# EAGLE design pot-boardE (EAGLE 6.6.0)
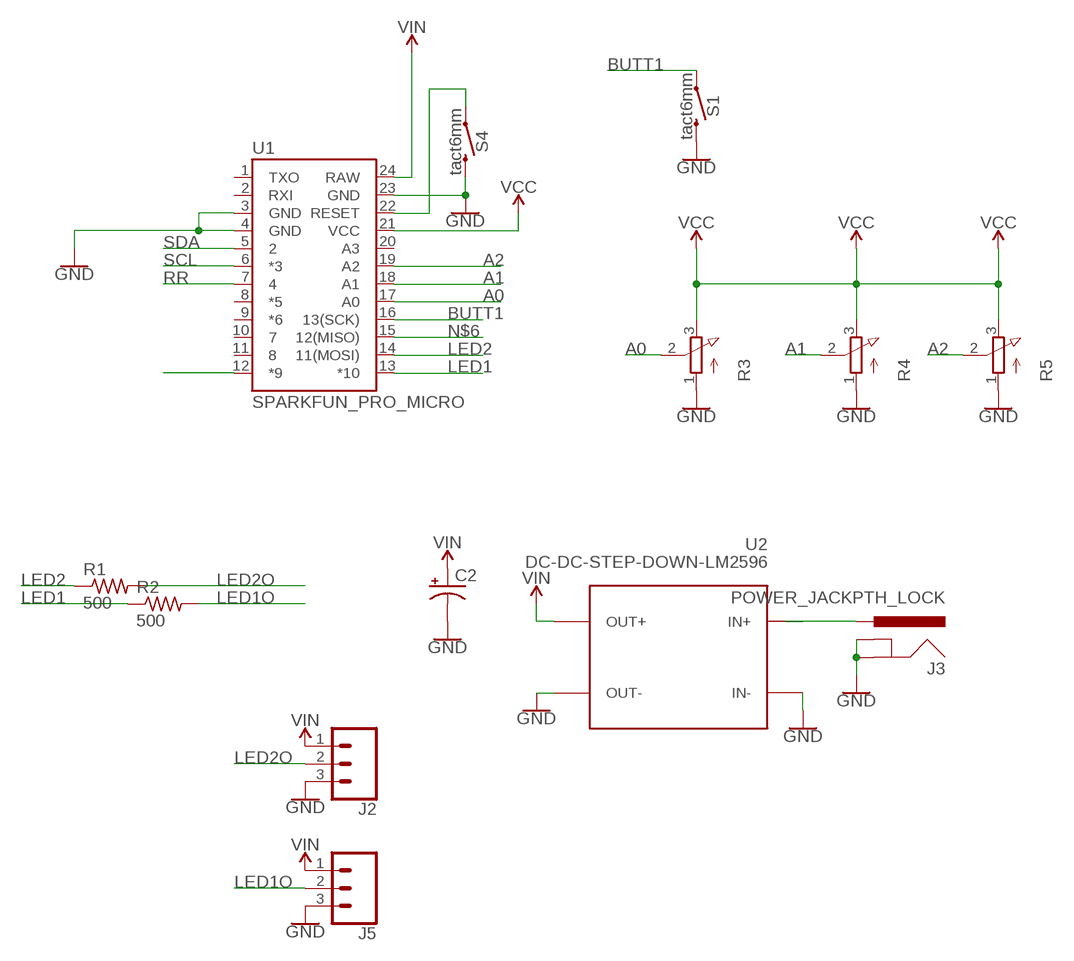
[diagram p0: schematic, sheet 1]

## Parts
C2  CPOL-USE3.5-8  [E3,5-8]
J2  CONN_03  [1X03]
J3  POWER_JACKPTH_LOCK  [POWER_JACK_PTH_LOCK]
J5  CONN_03  [1X03]
R1  500  R-US_R0805  [R0805]
R2  500  R-US_R0805  [R0805]
R3  3RP/1610N  [3RP/1610N]
R4  3RP/1610N  [3RP/1610N]
R5  3RP/1610N  [3RP/1610N]
S1  tact6mm  MOMENTARY-SWITCH-SPST-PTH-6.0MM  [TACTILE_SWITCH_PTH_6.0MM]
S4  tact6mm  MOMENTARY-SWITCH-SPST-PTH-6.0MM  [TACTILE_SWITCH_PTH_6.0MM]
U1  SPARKFUN_PRO_MICRO  [SPARKFUN_PRO_MICRO]
U2  DC-DC-STEP-DOWN-LM2596  [DC-DC-STEP-DOWN-LM2596]

## Nets
A0: R3.2(S) U1.17(A0)
A1: R4.2(S) U1.18(A1)
A2: R5.2(S) U1.19(A2)
BUTT1: S1.1 U1.16(13(SCK))
GND: C2.- J2.3 J3.GND J3.GNDBREAK J5.3 R3.1(A) R4.1(A) R5.1(A) S1.3 S4.3 U1.3(GND) U1.4(GND) U1.23(GND) U2.IN- U2.OUT-
LED1: R2.1 U1.13(*10)
LED1O: J5.2 R2.2
LED2: R1.1 U1.14(11(MOSI))
LED2O: J2.2 R1.2
N$1: J3.PWR U2.IN+
N$5: U1.12(*9)
N$6: U1.15(12(MISO))
RESET: S4.1 U1.22(RESET)
RR: U1.7
SCL: U1.6(*3)
SDA: U1.5
VCC: R3.3(E) R4.3(E) R5.3(E) U1.21(VCC)
VIN: C2.+ J2.1 J5.1 U1.24(RAW) U2.OUT+
Unconnected: U1.1(TXO) U1.2(RXI) U1.8(*5) U1.9(*6) U1.10 U1.11 U1.20(A3)

## Library data of the parts
C2 = adafruit:CPOL-US: POLARIZED CAPACITOR, American symbol
J2 J5 = SparkFun-Connectors:CONN_03: Multi connection point. Often used as Generic Header-pin footprint for 0.1 inch spaced/style header connections On any of the 0.1 inch spaced packages, you can populate with these: Break Away Headers - Straight <https://www.sparkfun.com/products/116> (PRT-00116) Break Away Male Headers - Right Angle <https://www.sparkfun.com/products/553> (PRT-00553) Female Headers <https://www.sparkfun.com/products/115> (PRT-00115) Break Away Headers - Machine Pin <https://www.sparkfun.com/products/117> (PRT-00117) Break Away Female Headers - Swiss Machine Pin <https://www.sparkfun.com/products/743> (PRT-00743) Stackable Header - 3 Pin (Female, 0.1") <https://www.sparkfun.com/products/13875> (PRT-13875) For SCREWTERMINALS and SPRING TERMINALS visit here: Screw Terimnals on SparkFun.com <https://www.sparkfun.com/search/results?term=Screw+Terminals> (5mm/3.5mm/2.54mm spacing) This device is also useful as a general connection point to wire up your design to another part of your project. Our various solder wires solder well into these plated through hole pads. Hook-Up Wire - Assortment (Stranded, 22 AWG) <https://www.sparkfun.com/products/11375> (PRT-11375) Hook-Up Wire - Assortment (Solid Core, 22 AWG) <https://www.sparkfun.com/products/11367> (PRT-11367) View the entire wire category on our website here <https://www.sparkfun.com/categories/141> Special notes: Molex polarized connector foot print use with SKU : PRT-08232 with associated crimp pins and housings.
J3 = SparkFun-Connectors:POWER_JACK: Power Jack Connector This is the standard 5.5mm barrel jack for power. The PTH is the most common, proven, reliable, footprint. The Slot footprint only works if the mill layer is transmitted to the PCB fab house so be warned. Here are the connectors we sell at SparkFun: DC Barrel Power Jack/Connector <https://www.sparkfun.com/products/119> (PRT-00119) DC Barrel Power Jack/Connector (SMD) <https://www.sparkfun.com/products/12748> (PRT-12748) DC Barrel Jack Adapter - Breadboard Compatible <https://www.sparkfun.com/products/10811> (PRT-10811) It is used on this SparkFun product (and many, many others): SparkFun RedBoard - Programmed with Arduino <https://www.sparkfun.com/products/12757> (DEV-12757) Also, if you need a mating power supply or connector, please check these out: Wall Adapter Power Supply - 9VDC 650mA <https://www.sparkfun.com/products/298> (TOL-00298) DC Barrel Jack Adapter - Male <https://www.sparkfun.com/products/10287> (PRT-10287); PROD_ID: CONN-08197; SF_ID: PRT-00119
R1 R2 = adafruit:R-US_: RESISTOR, American symbol
R3-R5 = pot:3RP/1610N: 16mm Potentiometer one level Source: http://www.alphapotentiometers.net/html/16mm_pot_2.html
S1 S4 = SparkFun-Switches:MOMENTARY-SWITCH-SPST: Momentary Switch (Pushbutton) - SPST Normally-open (NO) SPST momentary switches (buttons, pushbuttons). Variants PTH-12MM - 12mm square, through-hole Momentary Pushbutton Switch - 12mm Square <https://www.sparkfun.com/products/9190> (COM-09190) PTH-6.0MM, PTH-6.0MM-KIT - 6.0mm square, through-hole Mini Pushbutton Switch <https://www.sparkfun.com/products/97> (COM-00097) KIT package intended for soldering kit's - only one side of pads' copper is exposed. PTH-RIGHT-ANGLE-KIT - Right-angle, through-hole Right Angle Tactile Button <https://www.sparkfun.com/products/10791> - Used on SparkFun BigTime Watch Kit <https://www.sparkfun.com/products/11734> SMD-12MM - 12mm square, surface-mount Tactile Button - SMD (12mm) <https://www.sparkfun.com/products/12993> (COM-12993) Used on SparkFun PicoBoard <https://www.sparkfun.com/products/11888> SMD-4.5MM - 4.5mm Square Trackball Switch Used on SparkFun Blackberry Trackballer Breakout <https://www.sparkfun.com/products/13169> SMD-4.6MMX2.8MM - 4.60mm x 2.80mm, surface mount Used on SparkFun SAMD21 Mini Breakout <https://www.sparkfun.com/products/13664> SMD-5.2MM, SMD-5.2-REDUNDANT - 5.2mm square, surface-mount Mini Pushbutton Switch - SMD <https://www.sparkfun.com/products/8720> (COM-08720) Used on Arduino Pro Mini <https://www.sparkfun.com/products/11114> REDUNDANT package connects both switch circuits together SMD-6.0X3.5MM - 6.0 x 3.5mm, surface mount Momentary Reset Switch SMD <https://www.sparkfun.com/products/8229> (COM-08229) SMD-6.2MM-TALL - 6.2mm square, surface mount Tactile Button - SMD (6mm) <https://www.sparkfun.com/products/12992> Used on SparkFun Digital Sandbox <https://www.sparkfun.com/products/12651> SMD-RIGHT-ANGLE - Right-angle, surface mount Used on SparkFun Block for Intel® Edison - Arduino <https://www.sparkfun.com/products/13036>; PROD_ID: SWCH-08441; SF_SKU: COM-00097
U1 = SparkFun-Boards:SPARKFUN_PRO_MICRO: SparkFun Pro Micro Atmega32U4 compatible footprint. SparkFun Products: 3.3V/8MHz <https://www.sparkfun.com/products/12587> 5V/16MHz <https://www.sparkfun.com/products/12640>
U2 = diy-modules:DC-DC-STEP-DOWN-LM2596: DC/DC Step-Down Regulator based on LM2596-ADJ chip LM2596 datasheet available here: http://www.ti.com/lit/ds/symlink/lm2596.pdf Click here to find device on ebay.com <http://www.ebay.com/sch/lm2596+power+regulator>

## Board
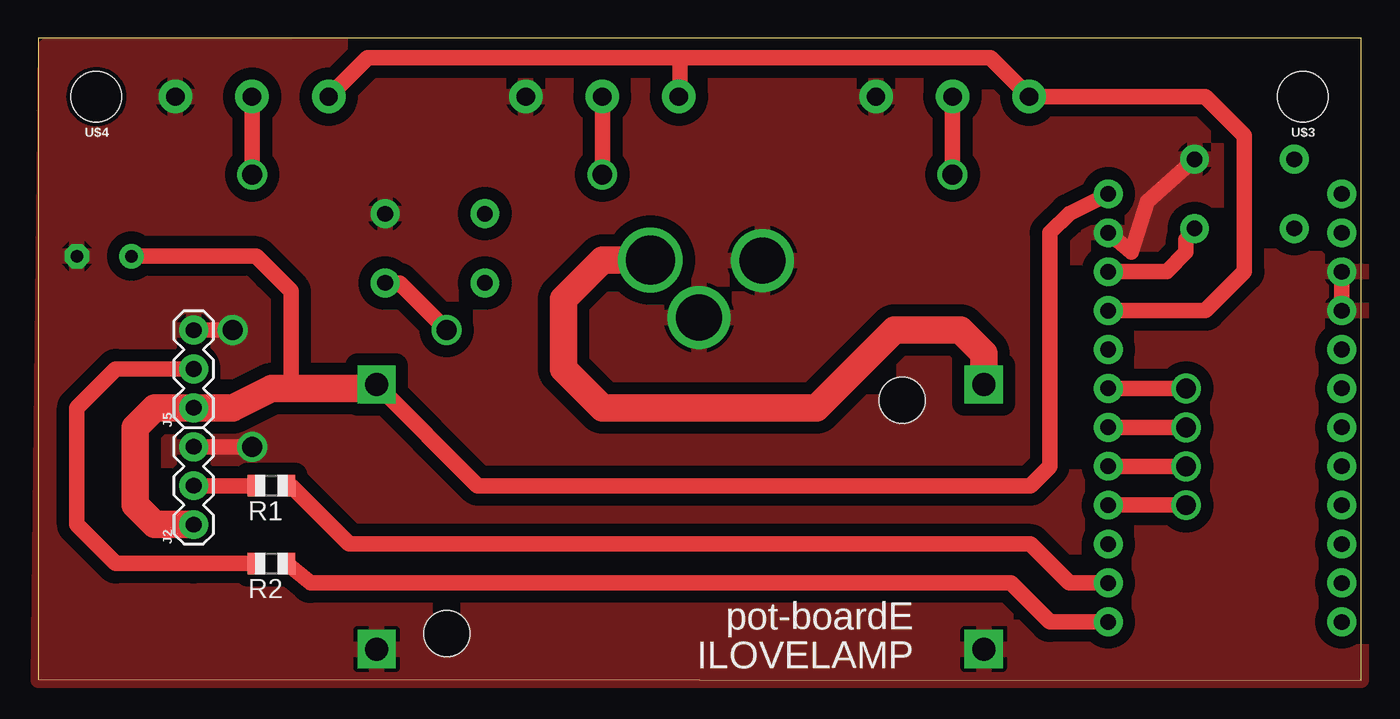
[diagram p1: board, top side]
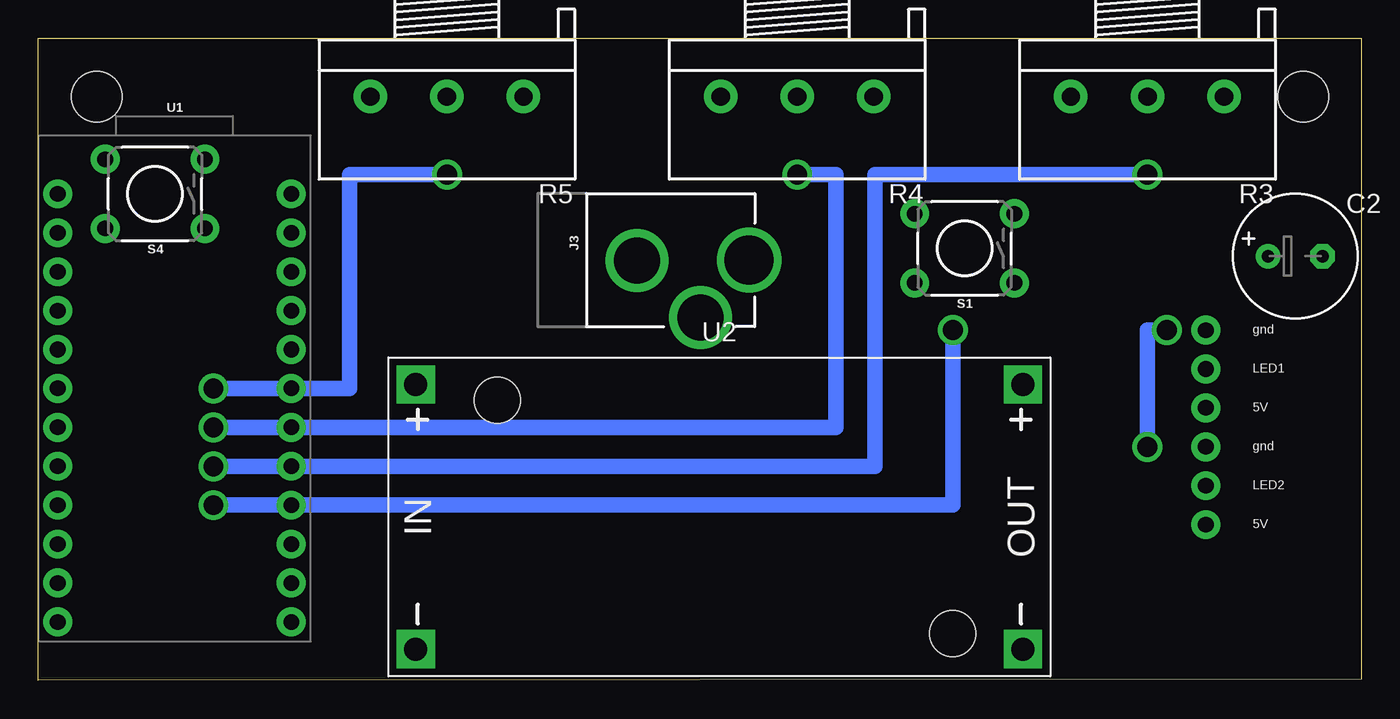
[diagram p2: board, bottom side, seen from below]

Size 86.34 x 41.91 mm. Coordinates in mm from the lower left corner, seen from the top.
Outline: 86.34,41.91 0,41.91 0,0.08 86.34,0 86.34,41.91
Copper layers (1*16): Top 0.035mm / dielectric 1.5mm / Bottom 0.035mm
Design rules "OthermillDRC_1_32_v2": minimum track width 8mil, minimum drill 0.8mm, track to track 0.794003125mm, track to pad 0.794003125mm, pad to pad 0.794003125mm, via to via 0.794003125mm, smd to smd 0mil, copper to edge 0mil, drill to drill 1mil, minimum pad ring 10mil, minimum via ring 10mil, stop-mask expansion 1mil, vias tented up to drill 30mil, thermal gap 10mil

### Footprints (pad centres in the part's own frame; a part is rotated, then mirrored left to right if it is on the bottom)
E3,5-8 = drill 0.813 pad 1.6: + -1.778,0 | drill 0.813 pad 1.6 octagon: - 1.778,0
1X03 = drill 1.016 pad 1.88: 1 0,0; 2 2.54,0; 3 5.08,0
POWER_JACK_PTH_LOCK = drill 2.997 pad 4.115: GND 0.025,6.557; GNDBREAK 3.762,10.7 | drill 3.2 pad 4.115: PWR 0,13.878
R0805 = smd 1.1 x 1.4: 1 -1,0; 2 1,0
3RP/1610N = drill 1.2 pad 2.184: 1 -5,0; 2 0,0; 3 5,0
TACTILE_SWITCH_PTH_6.0MM = drill 1.016 pad 1.88: 1 -3.251,2.261; 2 3.251,2.261; 3 -3.251,-2.261; 4 3.251,-2.261
SPARKFUN_PRO_MICRO = drill 1.016 pad 1.88: 1 -7.62,12.7; 2 -7.62,10.16; 3 -7.62,7.62; 4 -7.62,5.08; 5 -7.62,2.54; 6 -7.62,0; 7 -7.62,-2.54; 8 -7.62,-5.08; 9 -7.62,-7.62; 10 -7.62,-10.16; 11 -7.62,-12.7; 12 -7.62,-15.24; 13 7.62,-15.24; 14 7.62,-12.7; 15 7.62,-10.16; 16 7.62,-7.62; 17 7.62,-5.08; 18 7.62,-2.54; 19 7.62,0; 20 7.62,2.54; 21 7.62,5.08; 22 7.62,7.62; 23 7.62,10.16; 24 7.62,12.7
DC-DC-STEP-DOWN-LM2596 = drill 1.5 pad 2.5 square: IN+ -19.812,8.636; IN- -19.812,-8.636; OUT+ 19.812,8.636; OUT- 19.812,-8.636 | hole 3: -14.478,7.62; 15.24,-7.62
STAND-OFF = hole 3.302: 0,0

### Placement (x,y rotation side)
C2  4.3,27.69 0 bottom
J2  10.14,10.16 90 top
J3  53.83,27.43 270 bottom
J5  10.14,17.78 90 top
R1  15.22,12.7 180 top
R2  15.22,7.62 180 top
R3  13.95,38.1 180 bottom
R4  36.81,38.1 180 bottom
R5  59.67,38.1 180 bottom
S1  25.89,28.19 180 bottom
S4  78.72,31.75 180 bottom
U1  77.45,19.05 0 bottom
U2  41.89,10.67 0 bottom
U$3  [STAND-OFF]  82.53,38.1 180 top
U$4  [STAND-OFF]  3.79,38.1 180 top

### Tracks (layer width: path | path; a pad name or v marks a point on that pad's centre or on a via)
A0  (via drill 1.3)
  Top 1.016: U1.17 v74.91,13.97 | R3.2 v13.95,33.02
  Bottom 1.016: v74.91,13.97 57.13,13.97 39.35,13.97 31.73,13.97 31.73,33.02 v13.95,33.02
A1  (via drill 1.3)
  Top 1.016: U1.18 v74.91,16.51 | R4.2 v36.81,33.02
  Bottom 1.016: v74.91,16.51 58.4,16.51 34.27,16.51 34.27,33.02 v36.81,33.02
A2  (via drill 1.3)
  Top 1.016: U1.19 v74.91,19.05 | R5.2 v59.67,33.02
  Bottom 1.016: v74.91,19.05 66.02,19.05 66.02,33.02 v59.67,33.02
BUTT1  (via drill 1.3)
  Top 1.016: U1.16 v74.91,11.43 | S1.1 23.58,25.93 v26.65,22.86
  Bottom 1.016: v74.91,11.43 31.73,11.43 26.65,11.43 26.65,21.59 v26.65,22.86
GND  (via drill 1.3)
  Top 1.016: U1.3 U1.4 | U1.23 71.35,27.94 72.37,31.24 S4.3 | J2.3 v13.95,15.24 | v12.68,22.86 J5.3
  Bottom 1.016: v13.95,15.24 13.95,22.86 v12.68,22.86
  pour Top: -0.02,0 86.34,0 86.34,41.91 0.49,41.4
LED1
  Top 1.016: U1.13 66.02,3.81 63.48,6.35 17.76,6.35 R2.1
LED1O
  Top 1.016: R2.2 10.14,7.62 5.06,7.62 2.52,10.16 2.52,17.78 5.06,20.32 J5.2
LED2
  Top 1.016: U1.14 67.29,6.35 64.75,8.89 62.21,8.89 20.3,8.89 16.49,12.7 R1.1
LED2O
  Top 1.016: J2.2 R1.2
N$1
  Top 1.778: U2.IN+ 61.7,21.34 61.45,21.59 60.18,22.86 55.86,22.86 50.78,17.78 36.81,17.78 34.27,20.32 34.27,24.89 36.81,27.43 J3.PWR
RESET
  Top 1.016: U1.22 73.64,26.67 74.91,27.94 74.91,28.78 S4.1
VCC
  Top 1.016: 64.67,38.18 R5.3 | R4.3 41.89,38.18 41.89,40.64 | R3.3 21.49,40.64 25.38,40.64 41.89,40.64 | 41.89,40.64 62.13,40.64 R5.3 | U1.21 76.18,24.13 78.72,26.67 78.72,31.75 78.72,35.56 76.18,38.1 R5.3
VIN
  Top 1.016: U1.24 67.29,30.48 66.02,29.21 66.02,13.97 64.75,12.7 28.68,12.7 U2.OUT+ 21.82,19.05 | 15.22,19.05 12.68,17.78 | 16.49,19.05 16.49,25.4 15.22,26.67 14.2,27.69 C2.+
  Top 1.778: 21.82,19.05 16.49,19.05 15.22,19.05 12.68,17.78 J5.1 7.6,17.78 6.33,16.51 6.33,11.43 7.6,10.16 J2.1

### Text on the board
tPlace: pot-boardE | ILOVELAMP
bPlace: gnd | LED1 | 5V | gnd | LED2 | 5V